# Altium schematic sheet Sheet_1_2021-02-18.schdoc
size 316 x 199 mm
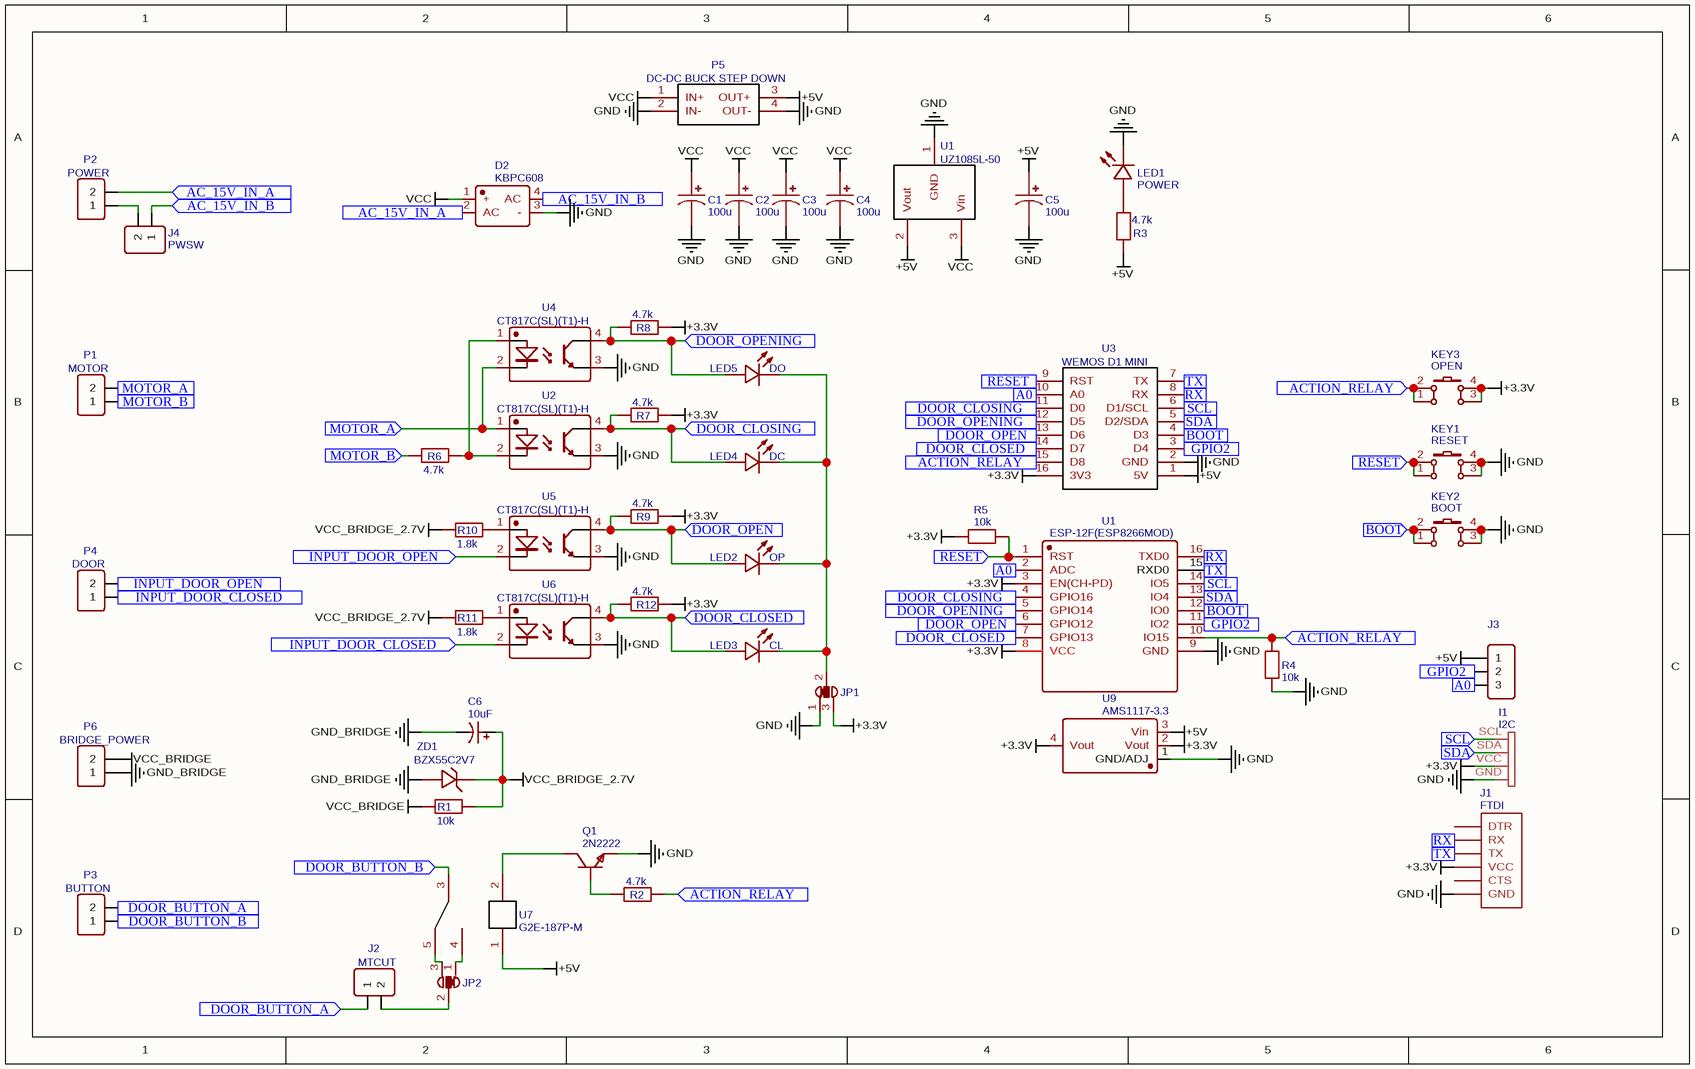
[diagram p0: Sheet_1_2021-02-18.schdoc]

## Parts
C1  100u  [CAP-D6.3×H5.5]
C2  100u  [CAP-D6.3×H5.5]
C3  100u  [CAP-D6.3×H5.5]
C4  100u  [CAP-D6.3×H5.5]
C5  100u  [CAP-D6.3×H5.5]
C6  10uF  [CAP-SMD_BD5.0-L5.3-W5.3-FD]
D2  KBPC608  [BR-6_4P-L15.2-W15.2-P10.8-BL]
I1  I2C  [I2C]
J1  FTDI  [FTDI]
J2  MTCUT  [HDR-M-2.54_1X2]
J3  HDR-M-2.54_1x3  [HDR-M-2.54_1X3]  (value not drawn)
J4  PWSW  [HDR-M-2.54_1X2]
JP1  SolderJumper_3_Bridged23-A500Components  [SOLDERJUMPER-3_P1.3MM_BRIDGED12_PAD1.0X1.5MM]  (value not drawn)
JP2  SolderJumper_3_Bridged23-A500Components  [SOLDERJUMPER-3_P1.3MM_BRIDGED12_PAD1.0X1.5MM]  (value not drawn)
KEY1  RESET  [KEY-TH_4P-L6.0-W6.0-P4.50-LS6.5]
KEY2  BOOT  [KEY-TH_4P-L6.0-W6.0-P4.50-LS6.5]
KEY3  OPEN  [KEY-TH_4P-L6.0-W6.0-P4.50-LS6.5]
LED1  POWER  [LED1206-R-RD]
LED2  OP  [LED1206-R-RD]
LED3  CL  [LED1206-R-RD]
LED4  DC  [LED1206-R-RD]
LED5  DO  [LED1206-R-RD]
P1  MOTOR  [CONN-TH_2P-P5.00]
P2  POWER  [CONN-TH_2P-P5.00]
P3  BUTTON  [CONN-TH_2P-P5.00]
P4  DOOR  [CONN-TH_2P-P5.00]
P5  DC-DC BUCK STEP DOWN  [DC-DC_BUCK]
P6  BRIDGE_POWER  [CONN-TH_2P-P5.00]
Q1  2N2222  [TO-92-3_L4.9-W3.7-P1.27-L]
R1  10k  [R1206]
R2  4.7k  [R1206]
R3  4.7k  [R1206]
R4  10k  [R1206]
R5  10k  [R1206]
R6  4.7k  [R1206]
R7  4.7k  [R1206]
R8  4.7k  [R1206]
R9  4.7k  [R1206]
R10  1.8k  [R1206]
R11  1.8k  [R1206]
R12  4.7k  [R1206]
U1  UZ1085L-50  [TO-263-3_L8.6-W10.2-P2.54-LS14.4-TL]
U2  CT817C(SL)(T1)-H  [CT817C]
U3  WEMOS D1 MINI  [WEMOS D1 MINI]
U4  CT817C(SL)(T1)-H  [CT817C]
U5  CT817C(SL)(T1)-H  [CT817C]
U6  CT817C(SL)(T1)-H  [CT817C]
U7  G2E-187P-M  [G2E-187P-M]
U8  esp12F  [ESP12F_SMD_MIN]  (value not drawn)
U9  AMS1117-3.3  [SOT-223-3_L6.5-W3.4-P2.30-LS7.0-BR]
ZD1  BZX55C2V7  [DO-35_BD2.0-L4.0-P8.00-D0.5-FD]

## Ports
A0 (in), AC_15V_IN_A (in), AC_15V_IN_B (in), ACTION_RELAY (in), BOOT (in), DOOR_BUTTON_A (in), DOOR_BUTTON_B (in), DOOR_CLOSED (in), DOOR_CLOSING (in), DOOR_OPEN (in), DOOR_OPENING (in), GPIO2 (in), INPUT_DOOR_CLOSED (in), INPUT_DOOR_OPEN (in), MOTOR_A (in), MOTOR_B (in), RESET (in), RX (in), SCL (in), SDA (in), TX (in)

## Nets
+3.3V: I1.VCC J1.4(VCC) JP1.3(A) KEY3.3 KEY3.4 R5.2 R7.1 R8.1 R9.1 R12.1 U3.16(3V3) U8.3(EN(CH-PD)) U8.8(VCC) U9.2(Vout) U9.4(Vout)
+5V: C5.1 J3.1 P5.3(OUT+) R3.2 U1.2(Vout) U3.1(5V) U7.1(COIL1) U9.3(Vin)
GND: C1.2 C2.2 C3.2 C4.2 C5.2 D2.3(-) I1.GND J1.6(GND) JP1.1(B) KEY1.3 KEY1.4 KEY2.3 KEY2.4 LED1.2(K) P5.2(IN-) P5.4(OUT-) Q1.1(E) R4.1 U1.1(GND) U2.3(EMITTER) U3.2(GND) U4.3(EMITTER) U5.3(EMITTER) U6.3(EMITTER) U8.9(GND) U9.1(GND/ADJ)
GND_BRIDGE: C6.2 P6.1 ZD1.1(A)
VCC: C1.1 C2.1 C3.1 C4.1 D2.1(+) P5.1(IN+) U1.3(Vin)
VCC_BRIDGE: P6.2 R1.1
VCC_BRIDGE_2.7V: C6.1 R1.2 R10.1 R11.1 ZD1.2(K)
A0: J3.3 U3.10(A0) U8.2(ADC) ; port A0
AC_15V_IN_A: D2.2(AC) P2.2 ; port AC_15V_IN_A
AC_15V_IN_B: D2.4(AC) J4.1 ; port AC_15V_IN_B
ACTION_RELAY: KEY3.1 KEY3.2 R2.1 R4.2 U3.15(D8) U8.10(IO15) ; port ACTION_RELAY
BOOT: KEY2.1 KEY2.2 U3.4(D3) U8.12(IO0) ; port BOOT
DOOR_BUTTON_A: J2.1 P3.2 ; port DOOR_BUTTON_A
DOOR_BUTTON_B: P3.1 U7.3(COM) ; port DOOR_BUTTON_B
DOOR_CLOSED: LED3.1(A) R12.2 U3.14(D7) U6.4(COLLECTOR) U8.7(GPIO13) ; port DOOR_CLOSED
DOOR_CLOSING: LED4.1(A) R7.2 U2.4(COLLECTOR) U3.11(D0) U8.4(GPIO16) ; port DOOR_CLOSING
DOOR_OPEN: LED2.1(A) R9.2 U3.13(D6) U5.4(COLLECTOR) U8.6(GPIO12) ; port DOOR_OPEN
DOOR_OPENING: LED5.1(A) R8.2 U3.12(D5) U4.4(COLLECTOR) U8.5(GPIO14) ; port DOOR_OPENING
GPIO2: J3.2 U3.3(D4) U8.11(IO2) ; port GPIO2
INPUT_DOOR_CLOSED: P4.1 U6.2(CATHODE) ; port INPUT_DOOR_CLOSED
INPUT_DOOR_OPEN: P4.2 U5.2(CATHODE) ; port INPUT_DOOR_OPEN
MOTOR_A: P1.2 U2.1(ANODE) U4.2(CATHODE) ; port MOTOR_A
MOTOR_B: P1.1 R6.1 ; port MOTOR_B
RESET: KEY1.1 KEY1.2 R5.1 U3.9(RST) U8.1(RST) ; port RESET
RX: J1.2(RX) U3.8(RX) U8.16(TXD0) ; port RX
SCL: I1.SCL U3.6(D1/SCL) U8.14(IO5) ; port SCL
SDA: I1.SDA U3.5(D2/SDA) U8.13(IO4) ; port SDA
TX: J1.3(TX) U3.7(TX) U8.15(RXD0) ; port TX
NetJ2_2: J2.2 JP2.2(C)
NetJ4_2: J4.2 P2.1
NetJP1_2: JP1.2(C) LED2.2(K) LED3.2(K) LED4.2(K) LED5.2(K)
NetJP2_1: JP2.1(B) U7.4(NO)
NetJP2_3: JP2.3(A) U7.5(NC)
NetLED1_1: LED1.1(A) R3.1
NetQ1_2: Q1.2(B) R2.2
NetQ1_3: Q1.3(C) U7.2(COIL2)
NetR6_2: R6.2 U2.2(CATHODE) U4.1(ANODE)
NetR10_2: R10.2 U5.1(ANODE)
NetR11_2: R11.2 U6.1(ANODE)

Not connected (* = marked no-connect by the designer): J1 1(DTR) 5(CTS)

## Notes on the sheet
- (in symbol esp12F) U1; ESP-12F(ESP8266MOD)

## Library data of the parts
C1-C5 = 100u: nameAlias: Value(F); Contributor: LCEDA_Lib; spicePre: C; spiceSymbolName: CE_SMD_D6.3×H5.5_US
C6 = 10uF: BOM_Manufacturer: ROQANG; BOM_Manufacturer Part: RVT1V100M0505; nameAlias: Capacitance; BOM_Supplier: LCSC; BOM_Supplier Part: C72486; spicePre: C; spiceSymbolName: RVT1V100M0505
D2 = KBPC608: BOM_Manufacturer: MDD; BOM_Supplier: LCSC; BOM_Manufacturer Part: KBPC608; image: //image.lceda.cn/szlcsc/C3084.jpg; BOM_Supplier Part: C3084; spicePre: D; spiceSymbolName: KBPC608
I1 = I2C: Contributor: waltertayler; spicePre: I; spiceSymbolName: I2C
J1 = FTDI: Contributor: cpu76239; spicePre: J; spiceSymbolName: FTDI
J2 = MTCUT: Contributor: LCEDA_Lib; BOM_Supplier Part: C124375; BOM_Supplier: LCSC; spicePre: J; spiceSymbolName: HDR-M-2.54_1x2
J3 = HDR-M-2.54_1x3: Contributor: LCEDA_Lib; BOM_Supplier Part: C180248; BOM_Supplier: LCSC; spicePre: J; spiceSymbolName: HDR-M-2.54_1x3
J4 = PWSW: Contributor: LCEDA_Lib; BOM_Supplier Part: C124375; BOM_Supplier: LCSC; spicePre: J; spiceSymbolName: HDR-M-2.54_1x2
JP1 JP2 = SolderJumper_3_Bridged23-A500Components: Contributor: Renee; spicePre: J; spiceSymbolName: SolderJumper_3_Bridged23-A500Components
KEY1 = RESET: BOM_Manufacturer: 韩国韩荣; BOM_Manufacturer Part: K2-1102DP-E4SW-04; Contributor: LCEDA_Lib; BOM_Supplier: LCSC; BOM_Supplier Part: C136684; spicePre: K; spiceSymbolName: K4-6×6_TH
KEY2 = BOOT: BOM_Manufacturer: 韩国韩荣; BOM_Manufacturer Part: K2-1102DP-E4SW-04; Contributor: LCEDA_Lib; BOM_Supplier: LCSC; BOM_Supplier Part: C136684; spicePre: K; spiceSymbolName: K4-6×6_TH
KEY3 = OPEN: BOM_Manufacturer: 韩国韩荣; BOM_Manufacturer Part: K2-1102DP-E4SW-04; Contributor: LCEDA_Lib; BOM_Supplier: LCSC; BOM_Supplier Part: C136684; spicePre: K; spiceSymbolName: K4-6×6_TH
LED1 = POWER: SMT Type: Extend; Contributor: M2k Pcb; image: //image.lceda.cn/szlcsc/C49018.jpg; BOM_Supplier Part: L001; BOM_LCSC Assembly: Yes; spicePre: L; spiceSymbolName: 1206 Red LED
LED2 = OP: SMT Type: Extend; Contributor: M2k Pcb; image: //image.lceda.cn/szlcsc/C49018.jpg; BOM_Supplier Part: L001; BOM_LCSC Assembly: Yes; spicePre: L; spiceSymbolName: 1206 Red LED
LED3 = CL: SMT Type: Extend; Contributor: M2k Pcb; image: //image.lceda.cn/szlcsc/C49018.jpg; BOM_Supplier Part: L001; BOM_LCSC Assembly: Yes; spicePre: L; spiceSymbolName: 1206 Red LED
LED4 = DC: SMT Type: Extend; Contributor: M2k Pcb; image: //image.lceda.cn/szlcsc/C49018.jpg; BOM_Supplier Part: L001; BOM_LCSC Assembly: Yes; spicePre: L; spiceSymbolName: 1206 Red LED
LED5 = DO: SMT Type: Extend; Contributor: M2k Pcb; image: //image.lceda.cn/szlcsc/C49018.jpg; BOM_Supplier Part: L001; BOM_LCSC Assembly: Yes; spicePre: L; spiceSymbolName: 1206 Red LED
P1 = MOTOR: Contributor: LCEDA_Lib; BOM_Supplier: LCSC; spicePre: P; spiceSymbolName: CONN-TH_2P-P5.00
P2 = POWER: Contributor: LCEDA_Lib; BOM_Supplier: LCSC; spicePre: P; spiceSymbolName: CONN-TH_2P-P5.00
P3 = BUTTON: Contributor: LCEDA_Lib; BOM_Supplier: LCSC; spicePre: P; spiceSymbolName: CONN-TH_2P-P5.00
P4 = DOOR: Contributor: LCEDA_Lib; BOM_Supplier: LCSC; spicePre: P; spiceSymbolName: CONN-TH_2P-P5.00
P5 = DC-DC BUCK STEP DOWN: BOM_Manufacturer: YOUR CEE; BOM_Manufacturer Part: BUCK CONVERTER; Contributor: Brendon Sultana; link: https://www.aliexpress.com/item/5-pcs-Ultra-Small-Size-DC-DC-Step-Down-Power-Supply-Module-3A-Adjustable-Step-Down/32261885063.html?spm=a2g0s.9042311.0.0.48a44c4dHCQiZa; spicePre: P; spiceSymbolName: DC-DC BUCK STEP DOWN CONVERTER
P6 = BRIDGE_POWER: Contributor: LCEDA_Lib; BOM_Supplier: LCSC; spicePre: P; spiceSymbolName: CONN-TH_2P-P5.00
Q1 = 2N2222: BOM_Manufacturer: SEMTECH; Contributor: LCSC; SMT Type: Extend; BOM_Supplier: LCSC; BOM_Manufacturer Part: 2N2222; BOM_Supplier Part: C118536; BOM_LCSC Assembly: Yes; spicePre: Q; spiceSymbolName: 2N2222
R1 R4 R5 = 10k: nameAlias: Value(Ω); Contributor: LCEDA_Lib; spicePre: R; spiceSymbolName: R_1206_EU
R2 R3 R6-R9 R12 = 4.7k: nameAlias: Value(Ω); Contributor: LCEDA_Lib; spicePre: R; spiceSymbolName: R_1206_EU
R10 R11 = 1.8k: nameAlias: Value(Ω); Contributor: LCEDA_Lib; spicePre: R; spiceSymbolName: R_1206_EU
U1 = UZ1085L-50: BOM_Manufacturer: UTC; BOM_Manufacturer Part: UZ1085L-50-TQ3-R; SMT Type: Extend; BOM_Supplier: LCSC; image: //image.lceda.cn/szlcsc/C75492.jpg; BOM_Supplier Part: C75492; BOM_LCSC Assembly: Yes; spicePre: U; spiceSymbolName: UZ1085L-50-TQ3-R
U2 U4-U6 = CT817C(SL)(T1)-H: BOM_Manufacturer: CT Micro International; Contributor: projakjo; SMT Type: Extend; BOM_Supplier: LCSC; BOM_Supplier Part: C191932; BOM_Manufacturer Part: CT817C(SL)(T1)-H; BOM_LCSC Assembly: Yes; spicePre: U; spiceSymbolName: CT817C(SL)(T1)-H
U3 = WEMOS D1 MINI: Contributor: Tobias Mayer; BOM_Manufacturer Part: Wemos D1 mini; spicePre: U; spiceSymbolName: WEMOS D1 MINI_ EIGEN COPY
U7 = G2E-187P-M: BOM_Manufacturer: OMRON; Contributor: TurtleForGaming; BOM_Manufacturer Part: G2E-187P-M; spicePre: U; spiceSymbolName: G2E-187P-M
U8 = esp12F: Contributor: dalnoboi; spicePre: U; spiceSymbolName: esp12F
U9 = AMS1117-3.3: BOM_Manufacturer: AMS; sourceId: dwIGgezVh; SMT Type: Basic; timeStamp: 1476261164; BOM_Supplier: LCSC; BOM_Manufacturer Part: AMS1117-3.3; image: //image.lceda.cn/szlcsc/C6186.jpg; BOM_Supplier Part: C6186; BOM_JLCPCB SMD: Yes; BOM_LCSC Assembly: Yes; spicePre: U; spiceSymbolName: AMS1117-3.3
ZD1 = BZX55C2V7: BOM_Manufacturer: SEMTECH; SMT Type: Extend; BOM_Supplier: LCSC; BOM_Manufacturer Part: BZX55C2V7; BOM_Supplier Part: C2505; BOM_LCSC Assembly: Yes; spicePre: Z; spiceSymbolName: BZX55C2V7